# EAGLE schematic single_pwm_mosfet_driver_with_npn_booster_3v (EAGLE 6.1)
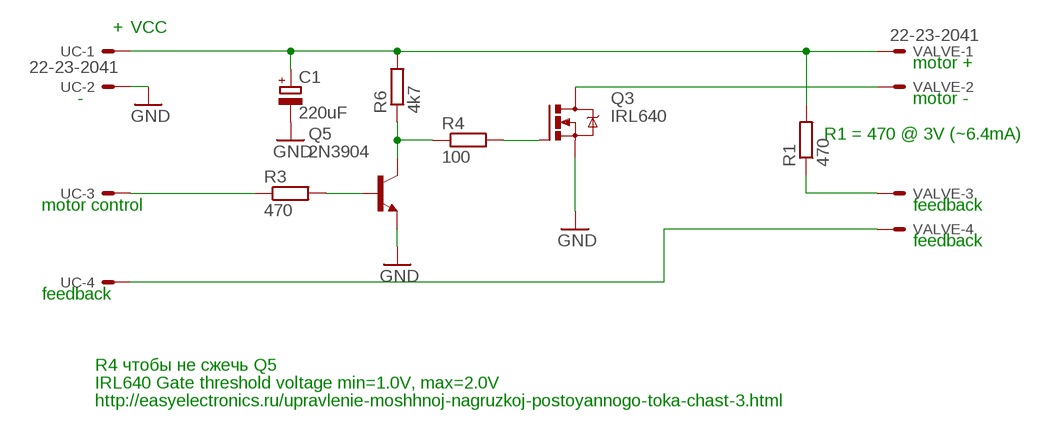
[diagram p0: schematic, sheet 1]

## Parts
C1  220uF  CPOL-EUE2.5-7  [E2,5-7]
Q3  IRL640  IRF740  [TO220BV]
Q5  2N3904  [TO92]
R1  470  R-EU_0207/7  [0207/7]
R3  470  R-EU_0207/7  [0207/7]
R4  100  R-EU_0207/7  [0207/7]
R6  4k7  R-EU_0207/7  [0207/7]
UC  22-23-2041  [22-23-2041]
VALVE  22-23-2041  [22-23-2041]

## Nets
GND: C1.- Q3.S Q5.3(E) UC.2
N$1: Q3.D VALVE.2
N$2: R3.1 UC.3
N$3: R1.1 VALVE.3
N$4: UC.4 VALVE.4
N$6: Q3.G R4.2
N$7: Q5.1(C) R4.1 R6.1
N$11: Q5.2(B) R3.2
N$19: C1.+ R1.2 R6.2 UC.1 VALVE.1

## Notes on the sheet
- + | VCC
- motor +
- - | motor -
- R1 = 470 @ 3V (~6.4mA)
- motor control | feedback
- feedback
- feedback
- R4 чтобы не сжечь Q5
- IRL640 Gate threshold voltage min=1.0V, max=2.0V
- http://easyelectronics.ru/upravlenie-moshhnoj-nagruzkoj-postoyannogo-toka-chast-3.html

## Library data of the parts
C1 = resistor:CPOL-EU: POLARIZED CAPACITOR, European symbol
Q3 = transistor-power:IRF740: N-CHANNEL MOS FET
Q5 = transistor-npn:2N3904: NPN Transistor
R1 R3 R4 R6 = resistor:R-EU_: RESISTOR, European symbol
UC VALVE = con-molex:22-23-2041: .100" (2.54mm) Center Header - 4 Pin; MF: MOLEX; MPN: 22-23-2041; OC_FARNELL: 1462920; OC_NEWARK: 38C0355